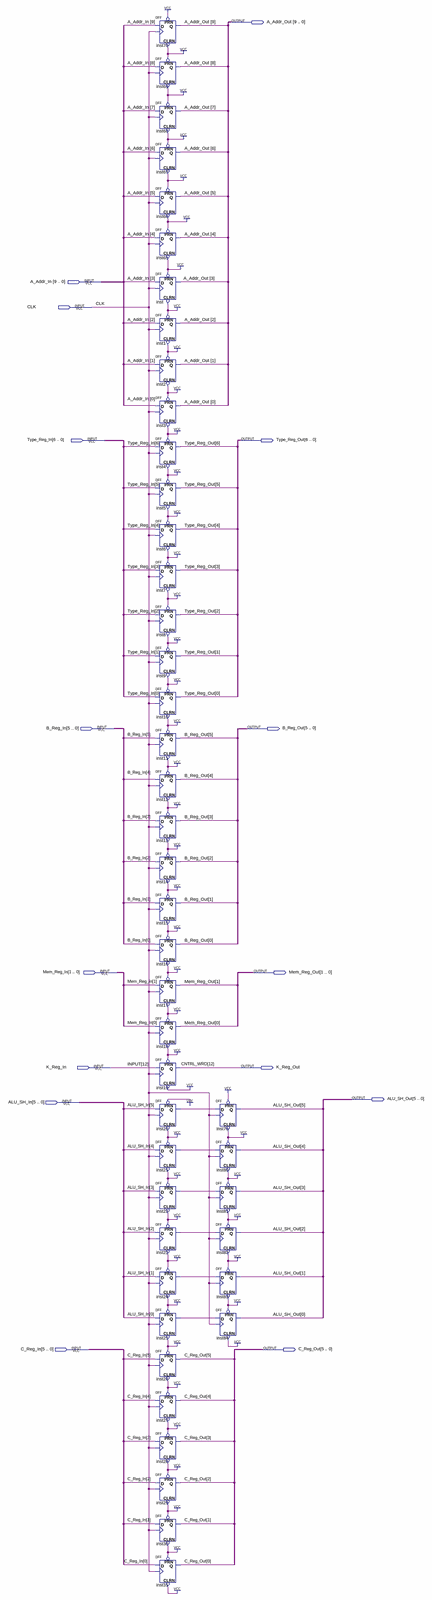
[diagram p0: schematic sheet, whole]
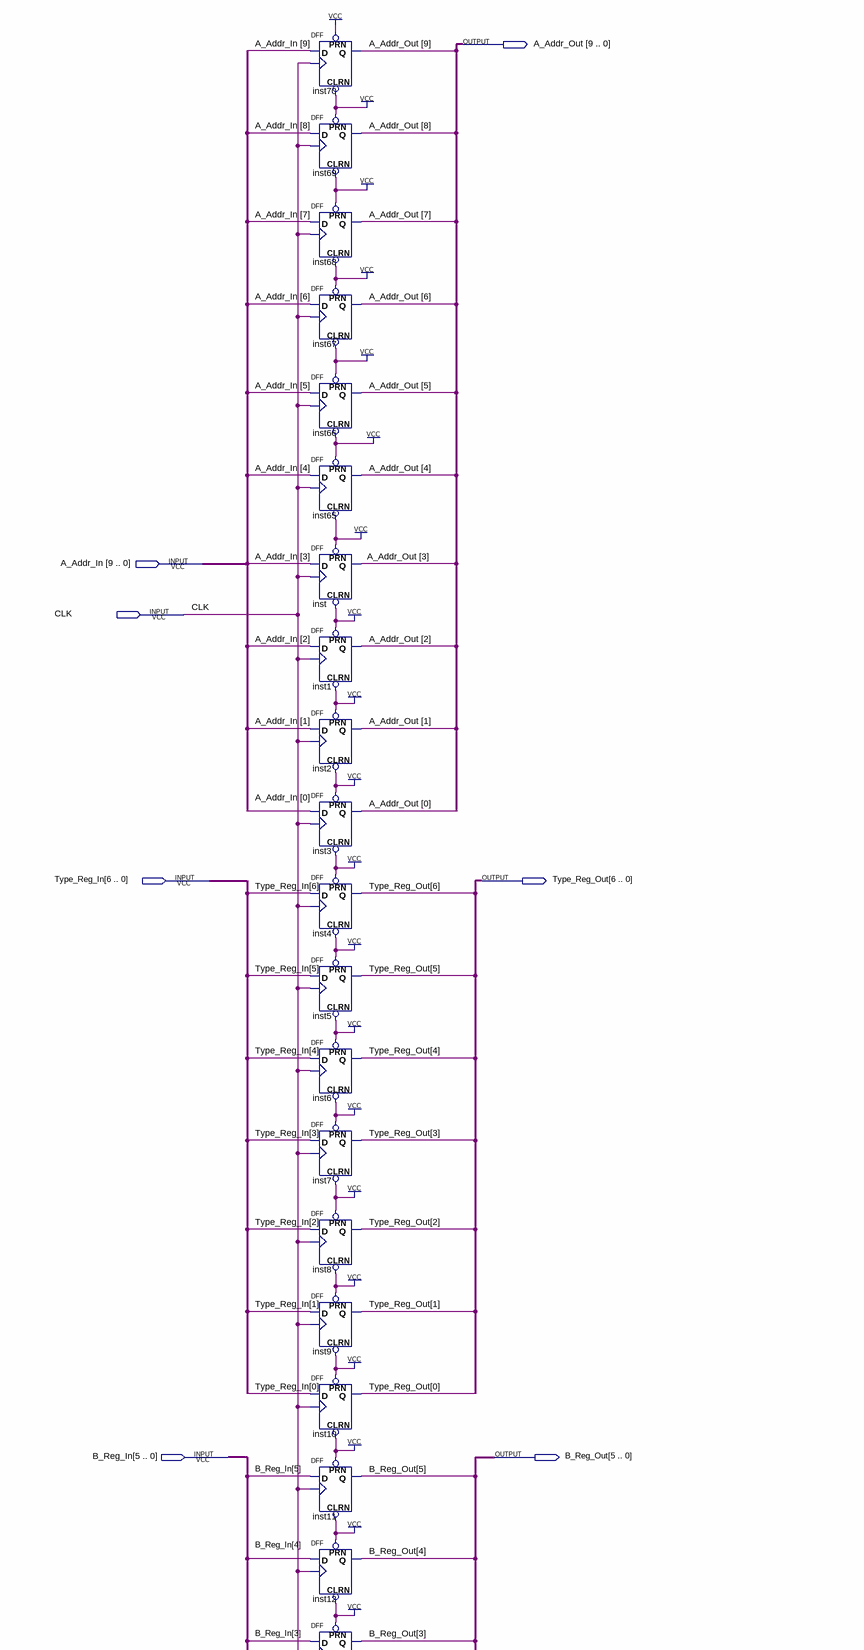
[diagram p1: schematic sheet, upper part]
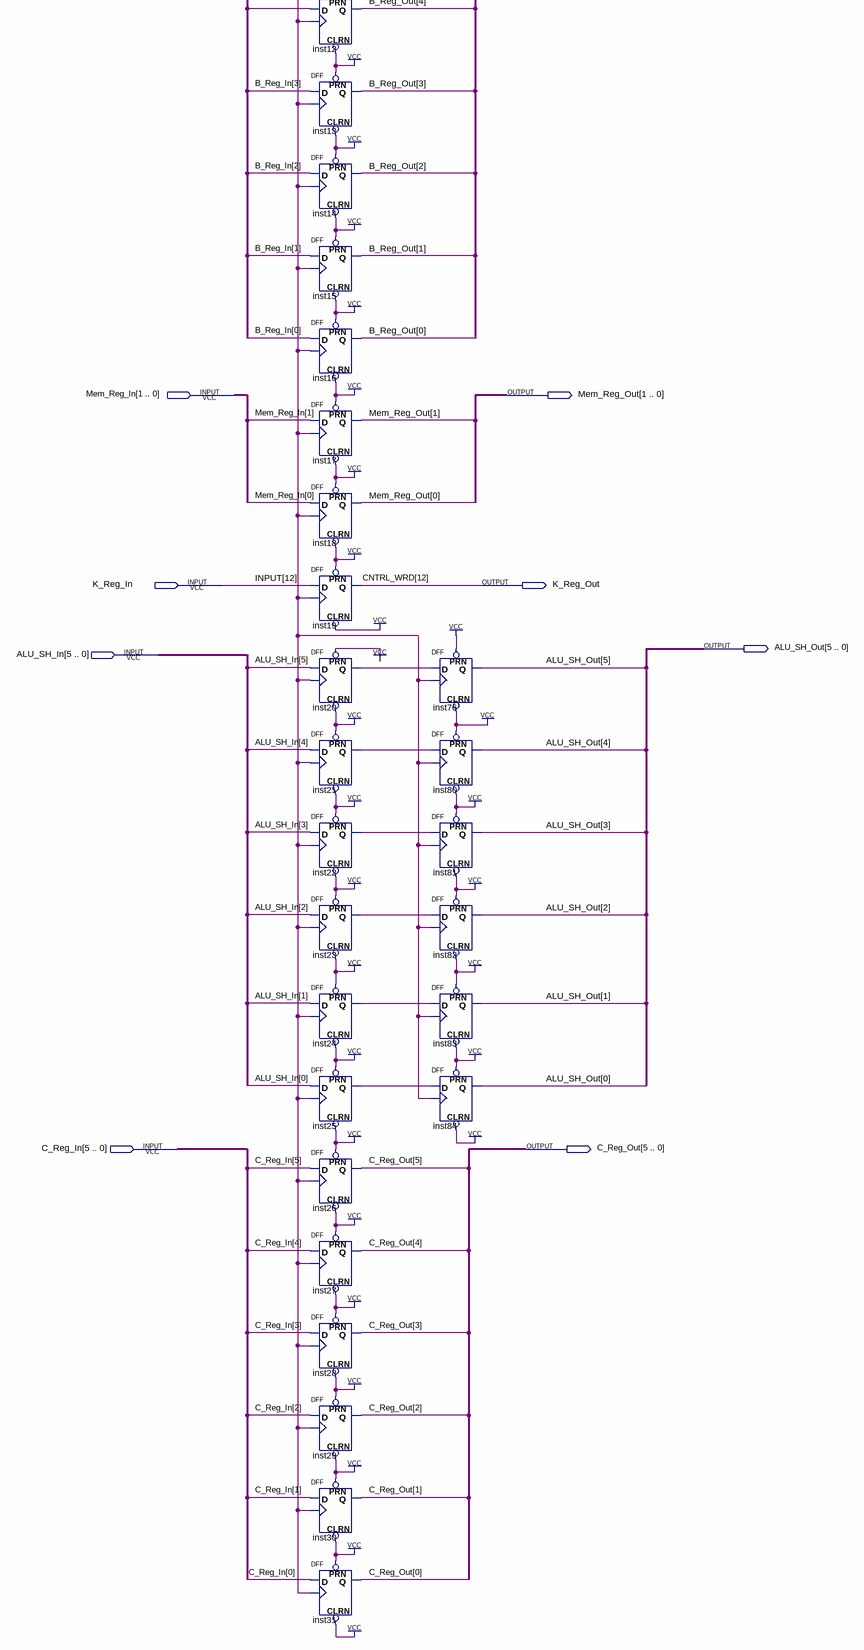
[diagram p2: schematic sheet, lower part]
// Quartus schematic Control_Word_Register.bdf as structural Verilog: 44 symbols, 15 pins
module Control_Word_Register (
  input  [9:0] A_Addr_In,
  input  CLK,
  input  [6:0] Type_Reg_In,
  input  [5:0] B_Reg_In,
  input  [1:0] Mem_Reg_In,
  input  K_Reg_In,
  input  [5:0] ALU_SH_In,
  input  [5:0] C_Reg_In,
  output [9:0] A_Addr_Out,
  output [6:0] Type_Reg_Out,
  output [5:0] B_Reg_Out,
  output [1:0] Mem_Reg_Out,
  output K_Reg_Out,
  output [5:0] ALU_SH_Out,
  output [5:0] C_Reg_Out
);

  wire inst20_q, inst21_q, inst22_q, inst23_q, inst24_q, inst25_q;

  DFF inst70 (.CLRN(1'b1), .CLK(CLK), .D(A_Addr_In[9]), .PRN(1'b1), .Q(A_Addr_Out[9]));
  DFF inst69 (.CLRN(1'b1), .CLK(CLK), .D(A_Addr_In[8]), .PRN(1'b1), .Q(A_Addr_Out[8]));
  DFF inst68 (.CLRN(1'b1), .CLK(CLK), .D(A_Addr_In[7]), .PRN(1'b1), .Q(A_Addr_Out[7]));
  DFF inst67 (.CLRN(1'b1), .CLK(CLK), .D(A_Addr_In[6]), .PRN(1'b1), .Q(A_Addr_Out[6]));
  DFF inst66 (.CLRN(1'b1), .CLK(CLK), .D(A_Addr_In[5]), .PRN(1'b1), .Q(A_Addr_Out[5]));
  DFF inst65 (.CLRN(1'b1), .CLK(CLK), .D(A_Addr_In[4]), .PRN(1'b1), .Q(A_Addr_Out[4]));
  DFF inst (.CLRN(1'b1), .CLK(CLK), .D(A_Addr_In[3]), .PRN(1'b1), .Q(A_Addr_Out[3]));
  DFF inst1 (.CLRN(1'b1), .CLK(CLK), .D(A_Addr_In[2]), .PRN(1'b1), .Q(A_Addr_Out[2]));
  DFF inst2 (.CLRN(1'b1), .CLK(CLK), .D(A_Addr_In[1]), .PRN(1'b1), .Q(A_Addr_Out[1]));
  DFF inst3 (.CLRN(1'b1), .CLK(CLK), .D(A_Addr_In[0]), .PRN(1'b1), .Q(A_Addr_Out[0]));
  DFF inst4 (.CLRN(1'b1), .CLK(CLK), .D(Type_Reg_In[6]), .PRN(1'b1), .Q(Type_Reg_Out[6]));
  DFF inst5 (.CLRN(1'b1), .CLK(CLK), .D(Type_Reg_In[5]), .PRN(1'b1), .Q(Type_Reg_Out[5]));
  DFF inst6 (.CLRN(1'b1), .CLK(CLK), .D(Type_Reg_In[4]), .PRN(1'b1), .Q(Type_Reg_Out[4]));
  DFF inst7 (.CLRN(1'b1), .CLK(CLK), .D(Type_Reg_In[3]), .PRN(1'b1), .Q(Type_Reg_Out[3]));
  DFF inst8 (.CLRN(1'b1), .CLK(CLK), .D(Type_Reg_In[2]), .PRN(1'b1), .Q(Type_Reg_Out[2]));
  DFF inst9 (.CLRN(1'b1), .CLK(CLK), .D(Type_Reg_In[1]), .PRN(1'b1), .Q(Type_Reg_Out[1]));
  DFF inst10 (.CLRN(1'b1), .CLK(CLK), .D(Type_Reg_In[0]), .PRN(1'b1), .Q(Type_Reg_Out[0]));
  DFF inst11 (.CLRN(1'b1), .CLK(CLK), .D(B_Reg_In[5]), .PRN(1'b1), .Q(B_Reg_Out[5]));
  DFF inst12 (.CLRN(1'b1), .CLK(CLK), .D(B_Reg_In[4]), .PRN(1'b1), .Q(B_Reg_Out[4]));
  DFF inst13 (.CLRN(1'b1), .CLK(CLK), .D(B_Reg_In[3]), .PRN(1'b1), .Q(B_Reg_Out[3]));
  DFF inst14 (.CLRN(1'b1), .CLK(CLK), .D(B_Reg_In[2]), .PRN(1'b1), .Q(B_Reg_Out[2]));
  DFF inst15 (.CLRN(1'b1), .CLK(CLK), .D(B_Reg_In[1]), .PRN(1'b1), .Q(B_Reg_Out[1]));
  DFF inst16 (.CLRN(1'b1), .CLK(CLK), .D(B_Reg_In[0]), .PRN(1'b1), .Q(B_Reg_Out[0]));
  DFF inst17 (.CLRN(1'b1), .CLK(CLK), .D(Mem_Reg_In[1]), .PRN(1'b1), .Q(Mem_Reg_Out[1]));
  DFF inst18 (.CLRN(1'b1), .CLK(CLK), .D(Mem_Reg_In[0]), .PRN(1'b1), .Q(Mem_Reg_Out[0]));
  DFF inst19 (.CLRN(1'b1), .CLK(CLK), .D(K_Reg_In), .PRN(1'b1), .Q(K_Reg_Out));
  DFF inst20 (.CLRN(1'b1), .CLK(CLK), .D(ALU_SH_In[5]), .PRN(1'b1), .Q(inst20_q));
  DFF inst21 (.CLRN(1'b1), .CLK(CLK), .D(ALU_SH_In[4]), .PRN(1'b1), .Q(inst21_q));
  DFF inst22 (.CLRN(1'b1), .CLK(CLK), .D(ALU_SH_In[3]), .PRN(1'b1), .Q(inst22_q));
  DFF inst23 (.CLRN(1'b1), .CLK(CLK), .D(ALU_SH_In[2]), .PRN(1'b1), .Q(inst23_q));
  DFF inst24 (.CLRN(1'b1), .CLK(CLK), .D(ALU_SH_In[1]), .PRN(1'b1), .Q(inst24_q));
  DFF inst25 (.CLRN(1'b1), .CLK(CLK), .D(ALU_SH_In[0]), .PRN(1'b1), .Q(inst25_q));
  DFF inst26 (.CLRN(1'b1), .CLK(CLK), .D(C_Reg_In[5]), .PRN(1'b1), .Q(C_Reg_Out[5]));
  DFF inst27 (.CLRN(1'b1), .CLK(CLK), .D(C_Reg_In[4]), .PRN(1'b1), .Q(C_Reg_Out[4]));
  DFF inst28 (.CLRN(1'b1), .CLK(CLK), .D(C_Reg_In[3]), .PRN(1'b1), .Q(C_Reg_Out[3]));
  DFF inst29 (.CLRN(1'b1), .CLK(CLK), .D(C_Reg_In[2]), .PRN(1'b1), .Q(C_Reg_Out[2]));
  DFF inst30 (.CLRN(1'b1), .CLK(CLK), .D(C_Reg_In[1]), .PRN(1'b1), .Q(C_Reg_Out[1]));
  DFF inst31 (.CLRN(1'b1), .CLK(CLK), .D(C_Reg_In[0]), .PRN(1'b1), .Q(C_Reg_Out[0]));
  DFF inst76 (.CLRN(1'b1), .CLK(CLK), .D(inst20_q), .PRN(1'b1), .Q(ALU_SH_Out[5]));
  DFF inst80 (.CLRN(1'b1), .CLK(CLK), .D(inst21_q), .PRN(1'b1), .Q(ALU_SH_Out[4]));
  DFF inst81 (.CLRN(1'b1), .CLK(CLK), .D(inst22_q), .PRN(1'b1), .Q(ALU_SH_Out[3]));
  DFF inst82 (.CLRN(1'b1), .CLK(CLK), .D(inst23_q), .PRN(1'b1), .Q(ALU_SH_Out[2]));
  DFF inst83 (.CLRN(1'b1), .CLK(CLK), .D(inst24_q), .PRN(1'b1), .Q(ALU_SH_Out[1]));
  DFF inst84 (.CLRN(1'b1), .CLK(CLK), .D(inst25_q), .PRN(1'b1), .Q(ALU_SH_Out[0]));

  // Other names for the same wires on the sheet: CNTRL_WRD[12] = K_Reg_Out; INPUT[12] = K_Reg_In
endmodule
